# EAGLE design flight comp v2 (EAGLE 9.4.2)
CNAME: FLIGHT COMPUTER; CREVISION: V1; DESIGNER: MICHAEL KIMANI
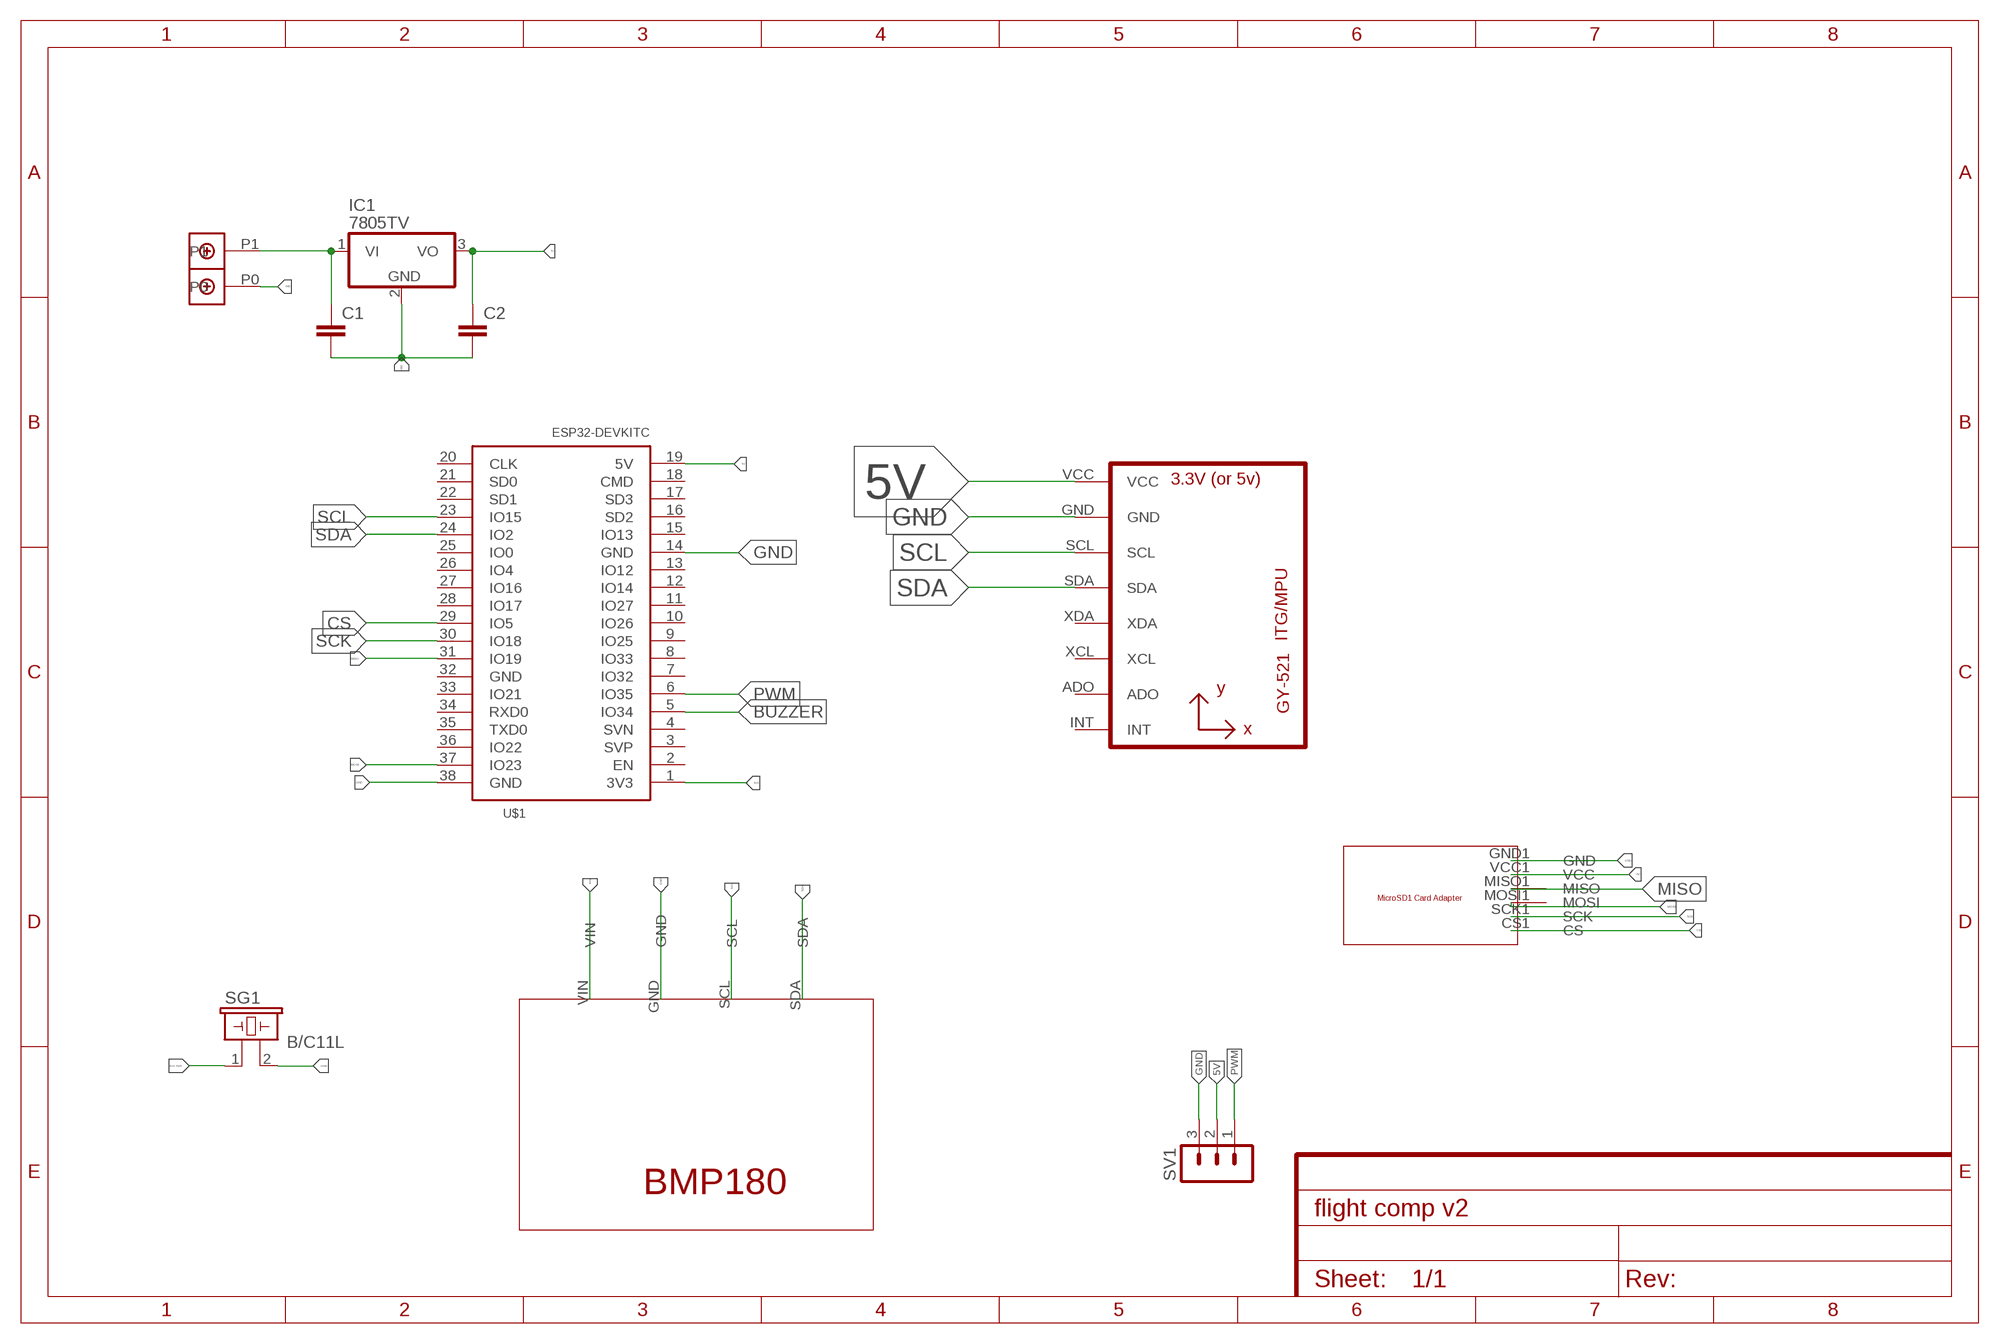
[diagram p0: schematic, sheet 1]

## Parts
C1  C2,5-3  [C2.5-3]
C2  C2,5-3  [C2.5-3]
IC1  7805TV  [TO220V]
SG1  B/C11L  [B/C11L]
SV1  MA03-1  [MA03-1]
U1  GY-521MPU6050  [GY-521]
U$1  ESP32DEVKITC  [ESP32-DEVKITC]
U$2  MICROSDADAPTER  [MICROSDADAPTER]
U$3  BMP180  [BMP180]
U$4  DBCONN-1X2  [DBCONN-1X2]

## Nets
3V3: U$1.1(3V3) U$3.VIN
5V: C2.1 IC1.3(VO) SV1.2 U1.VCC U$1.19(5V) U$2.VCC1(VCC)
BUZZER: SG1.1 U$1.5(IO34)
CS: U$1.29(IO5) U$2.CS1(CS)
GND: C1.2 C2.2 IC1.2(GND) SG1.2 SV1.3 U1.GND U$1.14(GND) U$1.38(GND) U$2.GND1(GND) U$3.GND U$4.P0
MISO: U$1.31(IO19) U$2.MISO1(MISO)
MOSI: U$1.37(IO23) U$2.MOSI1(MOSI)
N$1: C1.1 IC1.1(VI) U$4.P1
PWM: SV1.1 U$1.6(IO35)
SCK: U$1.30(IO18) U$2.SCK1(SCK)
SCL: U1.SCL U$1.23(IO15) U$3.SCL
SDA: U1.SDA U$1.24(IO2) U$3.SDA
Unconnected: U1.ADO U1.INT U1.XCL U1.XDA U$1.2(EN) U$1.3(SVP) U$1.4(SVN) U$1.7(IO32) U$1.8(IO33) U$1.9(IO25) U$1.10(IO26) U$1.11(IO27) U$1.12(IO14) U$1.13(IO12) U$1.15(IO13) U$1.16(SD2) U$1.17(SD3) U$1.18(CMD) U$1.20(CLK) U$1.21(SD0) U$1.22(SD1) U$1.25(IO0) U$1.26(IO4) U$1.27(IO16) U$1.28(IO17) U$1.32(GND) U$1.33(IO21) U$1.34(RXD0) U$1.35(TXD0) U$1.36(IO22)

## Library data of the parts
C1 C2 = capacitor-wima:C: CAPACITOR naming: grid - package width
IC1 = linear:78*: Positive VOLTAGE REGULATOR Source: http://cache.national.com/ds/LM/LM78L05.pdf http://www.fairchildsemi.com/ds/LM/LM7805.pdf
SG1 = buzzer:B/C11L: BUZZER Source: Buerklin; OC_FARNELL: unknown; OC_NEWARK: unknown
SV1 = con-lstb:MA03-1: PIN HEADER; OC_FARNELL: unknown; OC_NEWARK: unknown
U1 = gy-521:GY-521
U$1 = ESP32-DEVKITC:ESP32DEVKITC
U$2 = MicroSD Card Adapter:MICROSDADAPTER
U$3 = bmp1802:BMP180
U$4 = Terminal Block Connector:DBCONN-1X2

## Board
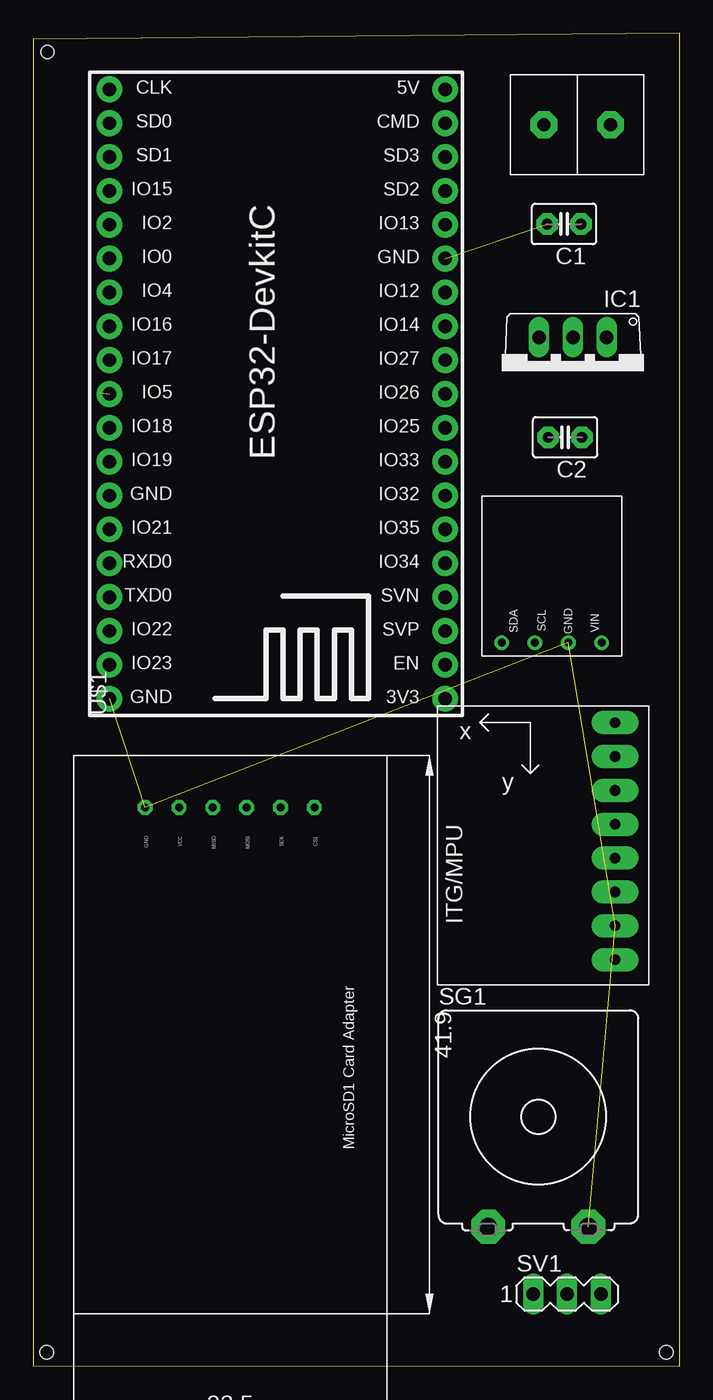
[diagram p1: board, top side]
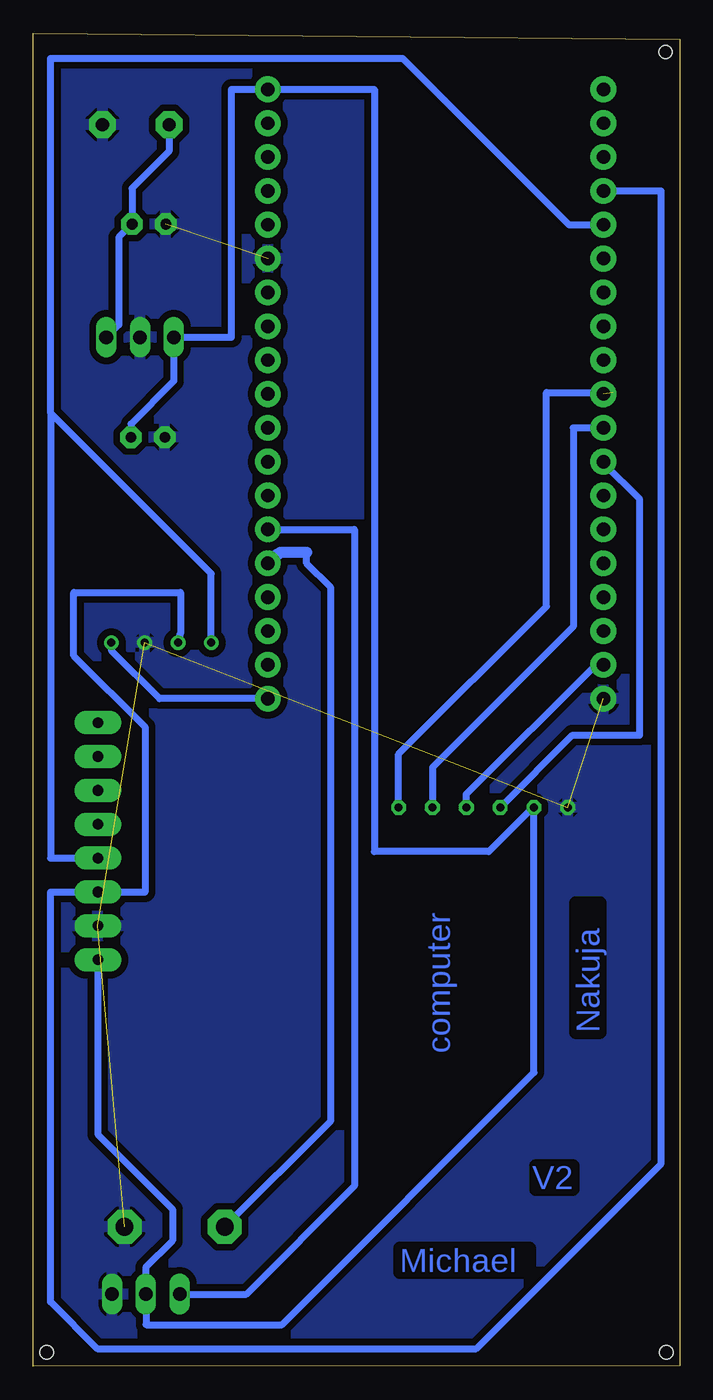
[diagram p2: board, bottom side, seen from below]

Size 48.51 x 100 mm. Coordinates in mm from the lower left corner, seen from the top.
Outline: 0,0.05 48.51,0 48.51,100 0,99.55 0,0.05
Copper layers (1*16): Top 0.035mm / dielectric 1.5mm / Bottom 0.035mm
Design rules "default *": minimum track width 20mil, minimum drill 0.35mm, track to track 20mil, track to pad 20mil, pad to pad 20mil, via to via 6mil, smd to smd 6mil, copper to edge 40mil, drill to drill 6mil, minimum pad ring 10mil, minimum via ring 8mil, stop-mask expansion 4mil, vias tented up to drill 0mil, thermal gap 10mil
Holes 1 mm at 1,1.05 1.05,98.6 47.5,1.05
Holes 0.4 mm at -82,105.05

### Footprints (pad centres in the part's own frame; a part is rotated, then mirrored left to right if it is on the bottom)
C2.5-3 = drill 0.813 pad 1.6 octagon: 1 -1.27,0; 2 1.27,0
TO220V = drill 1.016 long: 1 -2.54,-2.54; 2 0,-2.54; 3 2.54,-2.54
B/C11L = drill 1.321 pad 2.54 octagon: 1 -3.759,-8.255; 2 3.759,-8.255
MA03-1 = drill 1.016 long: 1 -2.54,0; 2 0,0; 3 2.54,0
GY-521 = drill 0.8 pad 1.778 long: ADO -8.89,-6.35; GND -8.89,6.35; INT -8.89,-8.89; SCL -8.89,3.81; SDA -8.89,1.27; VCC -8.89,8.89; XCL -8.89,-3.81; XDA -8.89,-1.27
ESP32-DEVKITC = drill 1 pad 1.93: 1 -22.87,-11.42; 2 -20.33,-11.42; 3 -17.79,-11.42; 4 -15.25,-11.42; 5 -12.71,-11.42; 6 -10.17,-11.42; 7 -7.63,-11.42; 8 -5.09,-11.42; 9 -2.55,-11.42; 10 -0.01,-11.42; 11 2.53,-11.42; 12 5.07,-11.42; 13 7.61,-11.42; 14 10.15,-11.42; 15 12.69,-11.42; 16 15.23,-11.42; 17 17.77,-11.42; 18 20.31,-11.42; 19 22.85,-11.42; 20 22.85,13.77; 21 20.31,13.77; 22 17.77,13.77; 23 15.23,13.77; 24 12.69,13.77; 25 10.15,13.77; 26 7.61,13.77; 27 5.07,13.77; 28 2.53,13.77; 29 -0.01,13.77; 30 -2.55,13.77; 31 -5.09,13.77; 32 -7.63,13.77; 33 -10.17,13.77; 34 -12.71,13.77; 35 -15.25,13.77; 36 -17.79,13.77; 37 -20.33,13.77; 38 -22.87,13.77
MICROSDADAPTER = drill 0.6 octagon: CS1 3.9,17.8; GND1 3.9,5.1; MISO1 3.9,10.18; MOSI1 3.9,12.72; SCK1 3.9,15.26; VCC1 3.9,7.64
BMP180 = drill 0.6: GND 4,11; SCL 6.5,11; SDA 9,11; VIN 1.5,11
DBCONN-1X2 = drill 1 pad 2 octagon: P0 -2.54,0; P1 2.46,0

### Placement (x,y rotation side)
C1  39.83,85.69 180 top
C2  39.91,69.69 180 top
IC1  40.5,74.66 180 top
SG1  37.9,18.71 0 top
SV1  40.06,5.41 0 top
U1  34.78,39.39 180 top
U$1  19.49,72.95 90 top
U$2  3.29,45.82 270 top
U$3  44.15,65.28 180 top
U$4  40.78,93.15 180 top

### Tracks (layer width: path | path; a pad name or v marks a point on that pad's centre or on a via)
3V3
  Bottom 0.508: U$1.1 39.03,50.08 42.65,53.7 U$3.VIN
5V
  Bottom 0.508: C2.1 41.18,70.69 37.96,73.91 IC1.3 33.64,77.2 33.64,95.8 U$1.19 22.91,95.8 22.91,38.6 14.32,38.6 11.01,41.92 U$2.VCC1 10.93,22.03 29.84,3.12 40.04,3.12 40.04,5.39 SV1.2 40.06,7.41 38.06,9.41 38.06,11.79 43.67,17.4 U1.VCC
BUZZER
  Bottom 0.508: 28,61.05 28,60.23 26.18,58.41 26.18,18.41 SG1.1
  Bottom 0.813: 28,61.05 29.98,61.05 30.13,60.9 30.25,60.9 U$1.5
CS  (1 unrouted)
  Bottom 0.508: U$2.CS1 21.09,45.92 10,57.01 10,73.05 5,73.05
GND  (5 unrouted)
  pour Bottom: -4,102.05 61,102.05 61,-13.95 66,-18.95 3,-18.95 -6,-9.95 -6,100.05
MISO
  Bottom 0.508: U$2.MISO1 8.04,47.35 3,47.35 3,65.05 5.72,67.77 U$1.31
MOSI
  Bottom 0.508: U$2.MOSI1 16.01,42.92 6.31,52.62 U$1.37
N$1
  Bottom 0.508: U$4.P1 38.32,91.15 41.1,88.37 C1.1 42.1,84.69 42.1,78.14 IC1.1
PWM
  Bottom 0.508: SV1.1 32.52,5.41 24.42,13.51 24.42,62.78 U$1.6
SCK
  Bottom 0.508: U$2.SCK1 18.55,44.92 7.99,55.48 7.99,70.4 U$1.30
SCL
  Bottom 0.508: U$3.SCL 37.47,54.96 37.47,58.05 45.47,58.05 45.47,53.3 40.13,47.96 40.13,35.58 U1.SCL 47.21,35.58 47.21,4.82 43.7,1.31 15.27,1.31 1.38,15.19 1.38,88.18 U$1.23
SDA
  Bottom 0.508: 47.21,71.51 35.15,59.45 U$3.SDA | 47.21,71.51 47.21,98.13 20.8,98.13 8.31,85.64 U$1.24 | 47.21,71.51 47.21,38.12 U1.SDA

### Text on the board
Bottom: computer | Nakuja | V2 | Michael